# Altium schematic sheet Instrumental Amplifire.SchDoc: Title
size A4; Date: *******; ApprovedBy: *******; CheckedBy: None; Author: *******; CompanyName: *******; DrawnBy: Name; Engineer: *******; Organization: *******; Address1: *******; Address2: *******; Address3: *******; Address4: *******; DocumentNumber: Doc Num; Revision: *******; SheetNumber: 4; SheetTotal: 8; Subtitle: Subtitle; Project: Project; VersionRevision: VersionRevision; TotalSheet: TotalSheet; CurrentTime: *******; CurrentDate: *******; Time: *******; DocumentFullPathAndName: *******; DocumentName: *******; ModifiedDate: *******; ImagePath: *******; ProjectName: *******; Application_BuildNumber: *******
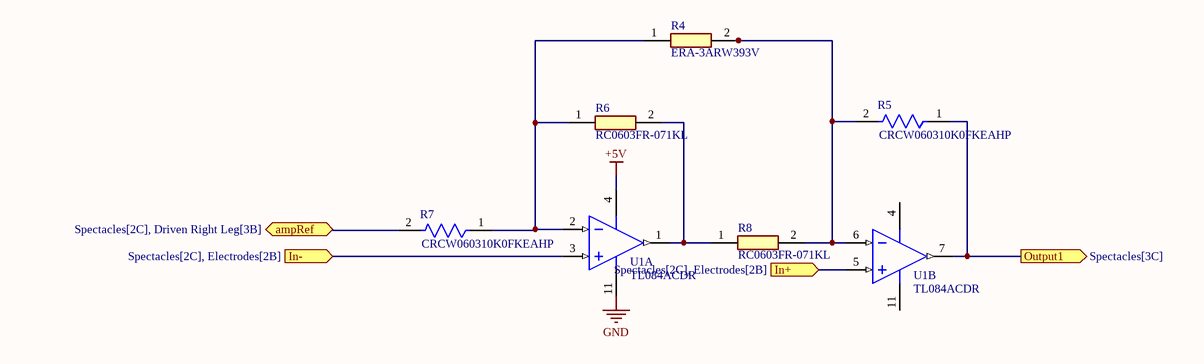
[diagram p0: Instrumental Amplifire.SchDoc]

## Parts
R4  ERA-3ARW393V  [ERA3AEB101V]
R5  CRCW060310K0FKEAHP  [FP-CRCW0603-HPe3-MFG]
R6  RC0603FR-071KL  [RESC1608X55N]
R7  CRCW060310K0FKEAHP  [FP-CRCW0603-HPe3-MFG]
R8  RC0603FR-071KL  [RESC1608X55N]
U1  TL084ACDR  [D0014A_N]  (parts A,B of 4)

## Ports
ampRef (bidir, see Spectacles[2C], Driven Right Leg[3B]), In+ (in, see Spectacles[2C], Electrodes[2B]), In- (in, see Spectacles[2C], Electrodes[2B]), Output1 (out, see Spectacles[3C])

## Nets
+5V: U1.4(VCC+)
GND: U1.11(VCC-)
ampRef: R7.2 ; port ampRef
In+: U1.5(IN2+) ; port In+
In-: U1.3(IN1+) ; port In-
Output1: R5.1 U1.7(OUT2) ; port Output1
NetR4_1: R4.1 R6.1 R7.1 U1.2(IN1-)
NetR4_2: R4.2 R5.2 R8.2 U1.6(IN2-)
NetR6_2: R6.2 R8.1 U1.1(OUT1)

## Notes on the sheet
- Title:
- Drawn By:
- Page Contents:
- Checked By:
- Subtitle:
- University Of Moratuwa
- Moratuwa
- Size:
- Date:
- File:
- Email:
- A4
- lasithnawanjaan123@gmail.com
- Lasith Haputhanthri
- Number:
- Time:
- Revision:
- Sheet
- of
- Katubedda
- 10500
- Sri Lanka

## Library data of the parts
R4 = ERA-3ARW393V: Resistor; Manufacturer_Name: Panasonic; Datasheet Link: https://industrial.panasonic.com/cdbs/www-data/pdf/RDM0000/AOA0000C307.pdf; Height: 0.55mm; Manufacturer_Part_Number: ERA-3ARW393V; Mouser Part Number: 667-ERA-3ARW393V; Mouser Price/Stock: https://www.mouser.co.uk/ProductDetail/Panasonic/ERA-3ARW393V?qs=ob%252BdNz2%252BYEhCihxnNm%252BJJA%3D%3D
R5 R7 = CMP-2000-03835-2: RES SMD 10K OHM 1% 1/3W 0603; Resistance: 10kR; Voltage Rating (DC): 75V; Max Power Dissipation: 250mW; Temperature Coefficient: 100ppm/°C; Case Code (Metric): 1608; Features: Automotive AEC-Q200; Termination: SMD/SMT; Number of Terminations: 2; Case Code (Imperial): 0603; Tolerance: 1%; Depth: 0.85mm; Package Quantity: 10; Length: 1.6mm; Packaging: Tape and Reel; Contact Plating: Tin; Radiation Hardening: No; Case/Package: 0603; Composition: Thick Film; Voltage Rating: 75V; Weight: 7.1E-05oz; Max Operating Temperature: 155°C; Lead Free: Lead Free; Width: 0.033inch; Power Rating: 250mW; Min Operating Temperature: -55°C; Military Standard: Not; Height: 0.45mm
R6 R8 = RC0603FR-071KL: Resistor; Manufacturer_Name: YAGEO; Datasheet Link: https://www.yageo.com/upload/media/product/productsearch/datasheet/rchip/PYu-RC_Group_51_RoHS_L_12.pdf; Height: 0.55mm; Manufacturer_Part_Number: RC0603FR-071KL; Mouser Part Number: 603-RC0603FR-071KL; Mouser Price/Stock: https://www.mouser.co.uk/ProductDetail/YAGEO/RC0603FR-071KL?qs=VU8sRB4EgwApHsk4rF%2F3zg%3D%3D; Arrow Part Number: RC0603FR-071KL; Arrow Price/Stock: https://www.arrow.com/en/products/rc0603fr-071kl/yageo?region=nac
U1 = CMP-0015-00026-2: JFET-Input Operational Amplifier, 7 to 36 V, 0 to 70 degC, 14-pin SOIC (D14), Green (RoHS & no Sb/Br); Manufacturer: Texas Instruments; Total Supply Voltage(Min)(+5V is 5, +/-5V is 10): 7; Rating: Catalog; Total Supply Voltage(Max)(+5V is 5, +/-5V is 10): 36; Vio (25C)(Max)(mV): 6; CMRR(Min)(dB): 75; Iq per channel(Max)(mA): 2.8; Offset Drift(Typ)(uV/C): 18; GBW(Typ)(MHz): 3; Slew Rate(Typ)(V/us): 13; Number of Channels: 4; Sub Family: General Purpose Amplifier, High Supply Voltage Amplifier (>=30V); IIB(Max)(pA): 200; Eco-Plan: Green (RoHS & no Sb/Br); ComponentLink2URL: http://www.ti.com/lit/ds/symlink/tl084a.pdf; ComponentLink2Description: Datasheet; PackageVersion: 4040047-5/M, 06/2011; Mounting Technology: Surface Mount; ComponentLink3Description: Package Specification; ComponentLink1Description: Manufacturer URL; PackageReference: D0014A; PartNumber: TL084ACDR; ComponentLink1URL: http://www.ti.com/; ComponentLink3URL: http://www.ti.com/lit/ml/mpds177g/mpds177g.pdf; PackageDescription: 14-Pin Plastic Small Outline, Body 8.65 x 3.90 mm, Pitch 1.27 mm; Code_JEDEC: MS-012; DatasheetVersion: SLOS081G; Vn at 1kHz(Typ)(nV/rtHz): 18